# EAGLE design cloudy1 (EAGLE 6.4)
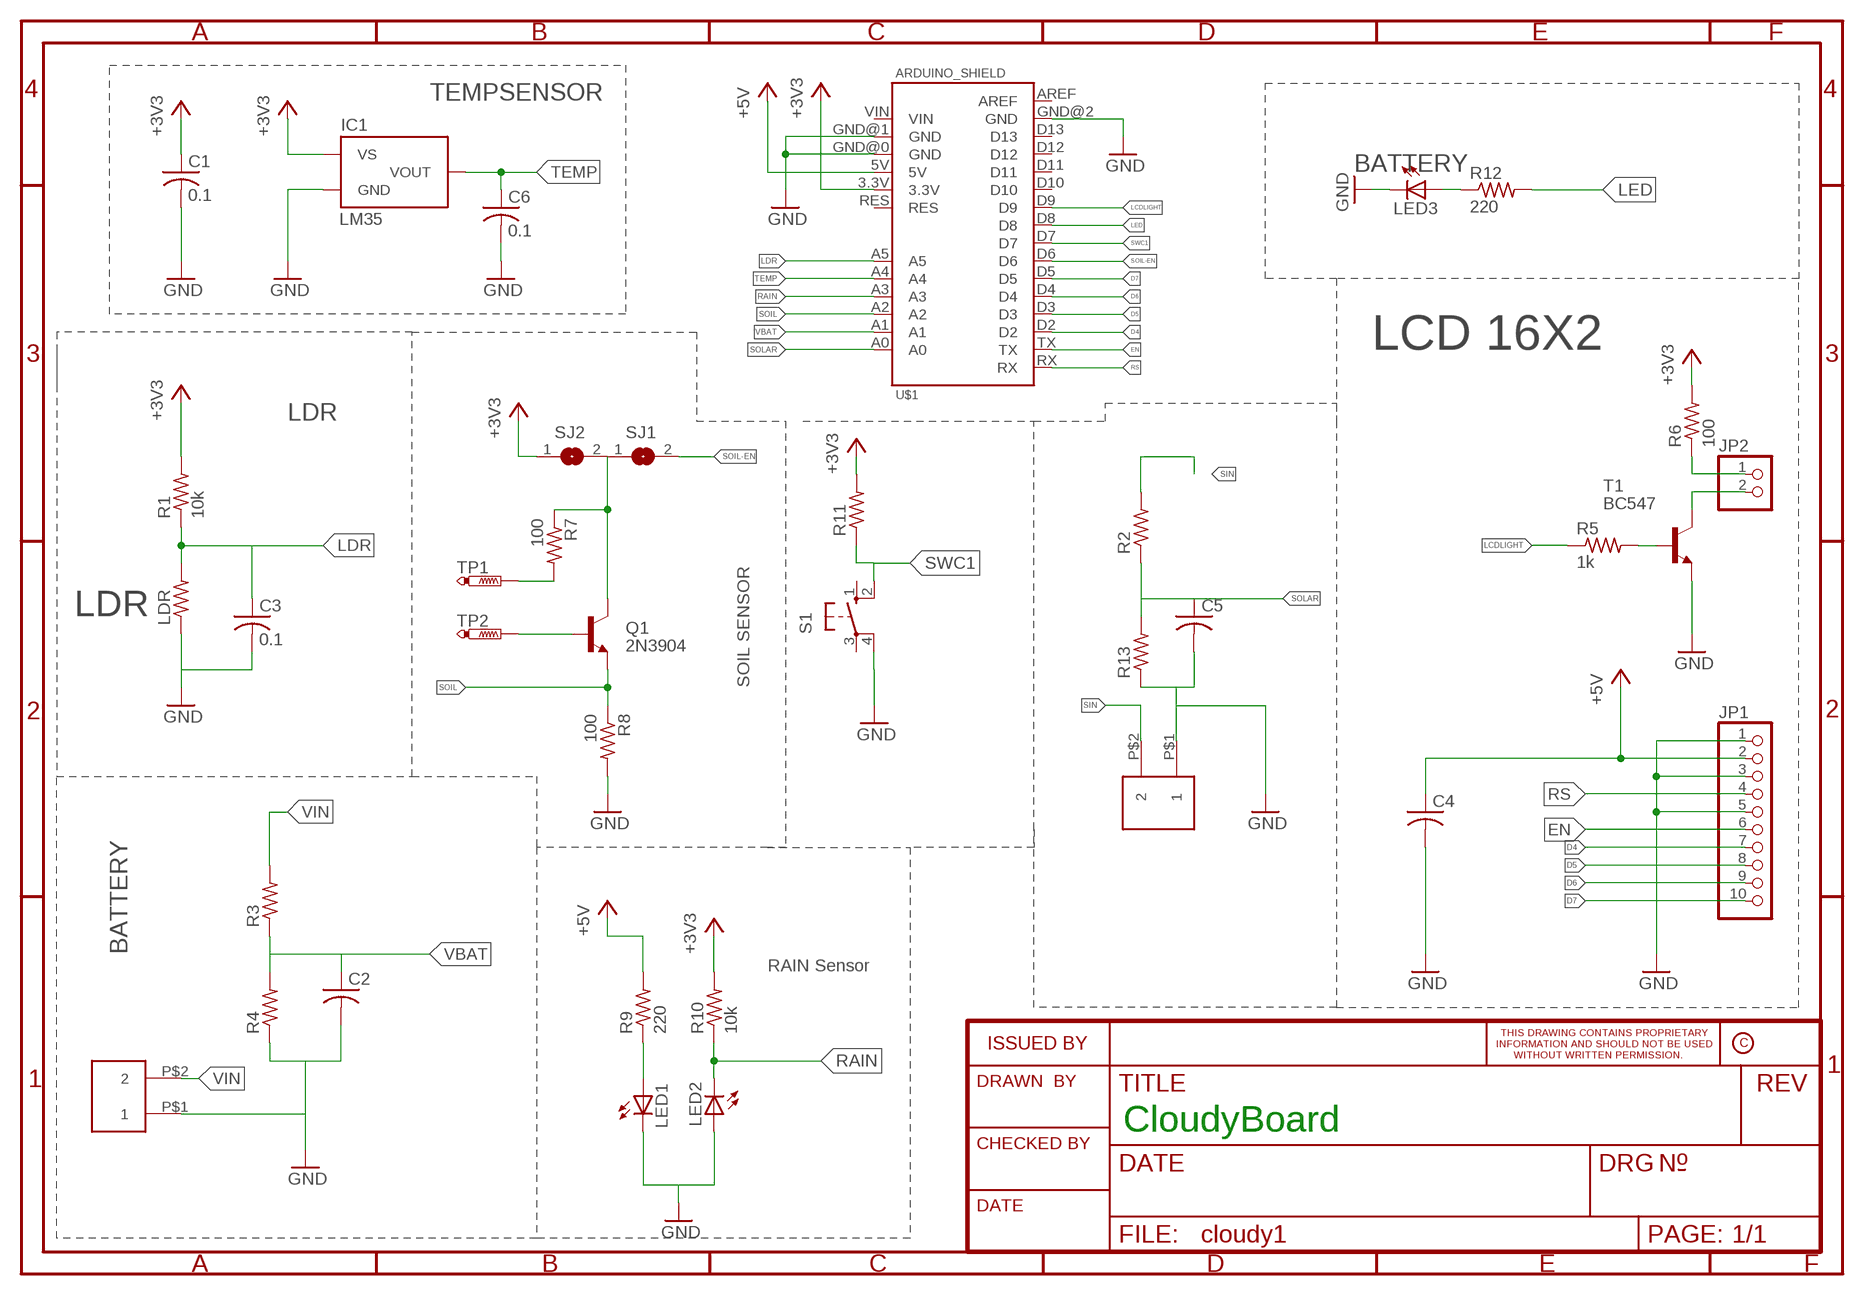
[diagram p0: schematic, sheet 1]

## Parts
C1  0.1  C-USC0805  [C0805]
C2  C-USC0805  [C0805]
C3  0.1  C-USC0805  [C0805]
C4  C-USC0805  [C0805]
C5  C-USC0805  [C0805]
C6  0.1  C-USC0805  [C0805]
IC1  LM35  [TO92]
JP1  PINHD-1X10  [1X10]
JP2  PINHD-1X2  [1X02]
LDR  R-US_0204/5  [0204/5]
LED1  LED5MM  [LED5MM]
LED2  LED5MM  [LED5MM]
LED3  LED5MM  [LED5MM]
Q1  2N3904  [TO92]
R1  10k  R-US_0204/7  [0204/7]
R2  R-US_0204/7  [0204/7]
R3  R-US_0204/7  [0204/7]
R4  R-US_0204/7  [0204/7]
R5  1k  R-US_0204/7  [0204/7]
R6  100  R-US_0204/7  [0204/7]
R7  100  R-US_R0805  [R0805]
R8  100  R-US_R0805  [R0805]
R9  220  R-US_0204/7  [0204/7]
R10  10k  R-US_0204/7  [0204/7]
R11  R-US_0207/10  [0207/10]
R12  220  R-US_0204/7  [0204/7]
R13  R-US_0204/7  [0204/7]
S1  10-XX  [B3F-10XX]
SJ1  SJ  [SJ]
SJ2  SJ  [SJ]
T1  BC547  [TO92]
TP1  PTR1TP19SQ  [TP19SQ]
TP2  PTR1TP19SQ  [TP19SQ]
U$1  ARDUINO_SHIELD  [ARDUINO_SHIELD]
U$2  POWER_TERMINAL  [POWER_TERMINAL_2]
U$3  POWER_TERMINAL  [POWER_TERMINAL_2]

## Nets
+3V3: C1.1 IC1.VS R1.2 R6.2 R10.2 R11.2 SJ2.1 U$1.3.3V
+5V: C4.1 JP1.2 R9.2 U$1.5V
D4: JP1.7 U$1.D2
D5: JP1.8 U$1.D3
D6: JP1.9 U$1.D4
D7: JP1.10 U$1.D5
EN: JP1.6 U$1.TX
GND: C1.2 C2.2 C3.2 C4.2 C5.2 C6.2 IC1.GND JP1.1 JP1.3 JP1.5 LDR.1 LED1.K(C) LED2.A LED3.K(C) R4.1 R8.2 R13.1 S1.4(P1) T1.1(E) U$1.GND@0(GND) U$1.GND@1(GND) U$1.GND@2(GND) U$2.P$1 U$3.P$1
LCDLIGHT: R5.1 U$1.D9
LDR: C3.1 LDR.2 R1.1 U$1.A5
LED: R12.2 U$1.D8
N$1: JP2.1 R6.1
N$2: JP2.2 T1.3(C)
N$3: R5.2 T1.2(B)
N$4: Q1.2(B) TP2.TP
N$5: R7.2 TP1.TP
N$6: Q1.1(C) R7.1 SJ1.1 SJ2.2
N$7: LED1.A R9.1
N$8: LED3.A R12.1
RAIN: LED2.K(C) R10.1 U$1.A3
RS: JP1.4 U$1.RX
SIN: R2.2 U$3.P$2
SOIL: Q1.3(E) R8.1 U$1.A2
SOIL-EN: SJ1.2 U$1.D6
SOLAR: C5.1 R2.1 R13.2 U$1.A0
SWC1: R11.1 S1.2(S1) U$1.D7
TEMP: C6.1 IC1.VOUT U$1.A4
VBAT: C2.1 R3.1 R4.2 U$1.A1
VIN: R3.2 U$2.P$2
Unconnected: S1.1(S) S1.3(P) U$1.AREF U$1.D10 U$1.D11 U$1.D12 U$1.D13 U$1.RES U$1.VIN

## Notes on the sheet
- TEMPSENSOR
- BATTERY
- LCD 16X2
- LDR
- LDR
- SOIL SENSOR
- BATTERY
- RAIN Sensor
- CloudyBoard

## Library data of the parts
C1-C6 = rcl:C-US: CAPACITOR, American symbol
IC1 = CEDT:LM35
JP1 = pinhead:PINHD-1X10: PIN HEADER
JP2 = pinhead:PINHD-1X2: PIN HEADER
LDR R1-R13 = rcl:R-US_: RESISTOR, American symbol
LED1-LED3 = led:LED: LED OSRAM: - CHIPLED LG R971, LG N971, LY N971, LG Q971, LY Q971, LO R971, LY R971 LH N974, LH R974 LS Q976, LO Q976, LY Q976 LO Q996 - Hyper CHIPLED LW Q18S LB Q993, LB Q99A, LB R99A - SideLED LS A670, LO A670, LY A670, LG A670, LP A670 LB A673, LV A673, LT A673, LW A673 LH A674 LY A675 LS A676, LA A676, LO A676, LY A676, LW A676 LS A679, LY A679, LG A679 - Hyper Micro SIDELED® LS Y876, LA Y876, LO Y876, LY Y876 LT Y87S - SmartLED LW L88C, LW L88S LB L89C, LB L89S, LG L890 LS L89K, LO L89K, LY L89K LS L896, LA L896, LO L896, LY L896 - TOPLED LS T670, LO T670, LY T670, LG T670, LP T670 LSG T670, LSP T670, LSY T670, LOP T670, LYG T670 LG T671, LOG T671, LSG T671 LB T673, LV T673, LT T673, LW T673 LH T674 LS T676, LA T676, LO T676, LY T676, LB T676, LH T676, LSB T676, LW T676 LB T67C, LV T67C, LT T67C, LS T67K, LO T67K, LY T67K, LW E67C LS E67B, LA E67B, LO E67B, LY E67B, LB E67C, LV E67C, LT E67C LW T67C LS T679, LY T679, LG T679 LS T770, LO T770, LY T770, LG T770, LP T770 LB T773, LV T773, LT T773, LW T773 LH T774 LS E675, LA E675, LY E675, LS T675 LS T776, LA T776, LO T776, LY T776, LB T776 LHGB T686 LT T68C, LB T68C - Hyper Mini TOPLED® LB M676 - Mini TOPLED Santana® LG M470 LS M47K, LO M47K, LY M47K Source: http://www.osram.convergy.de LUXEON: - LUMILED® LXK2-PW12-R00, LXK2-PW12-S00, LXK2-PW14-U00, LXK2-PW14-V00 LXK2-PM12-R00, LXK2-PM12-S00, LXK2-PM14-U00 LXK2-PE12-Q00, LXK2-PE12-R00, LXK2-PE12-S00, LXK2-PE14-T00, LXK2-PE14-U00 LXK2-PB12-K00, LXK2-PB12-L00, LXK2-PB12-M00, LXK2-PB14-N00, LXK2-PB14-P00, LXK2-PB14-Q00 LXK2-PR12-L00, LXK2-PR12-M00, LXK2-PR14-Q00, LXK2-PR14-R00 LXK2-PD12-Q00, LXK2-PD12-R00, LXK2-PD12-S00 LXK2-PH12-R00, LXK2-PH12-S00 LXK2-PL12-P00, LXK2-PL12-Q00, LXK2-PL12-R00 Source: www.luxeon.com KINGBRIGHT: KA-3528ASYC Source: www.kingbright.com
Q1 = transistor-npn:2N3904: NPN Transistor
S1 = CEDT:10-XX: OMRON SWITCH
SJ1 SJ2 = jumper:SJ: SMD solder JUMPER
T1 = transistor:BC547: NPN TRANSISTOR
TP1 TP2 = testpad:PTR1: TEST PIN
U$1 = CEDTv66:ARDUINO_SHIELD: Standard footprint for Arduino Shield.
U$2 U$3 = Rohit_Libsv2:POWER_TERMINAL

## Board
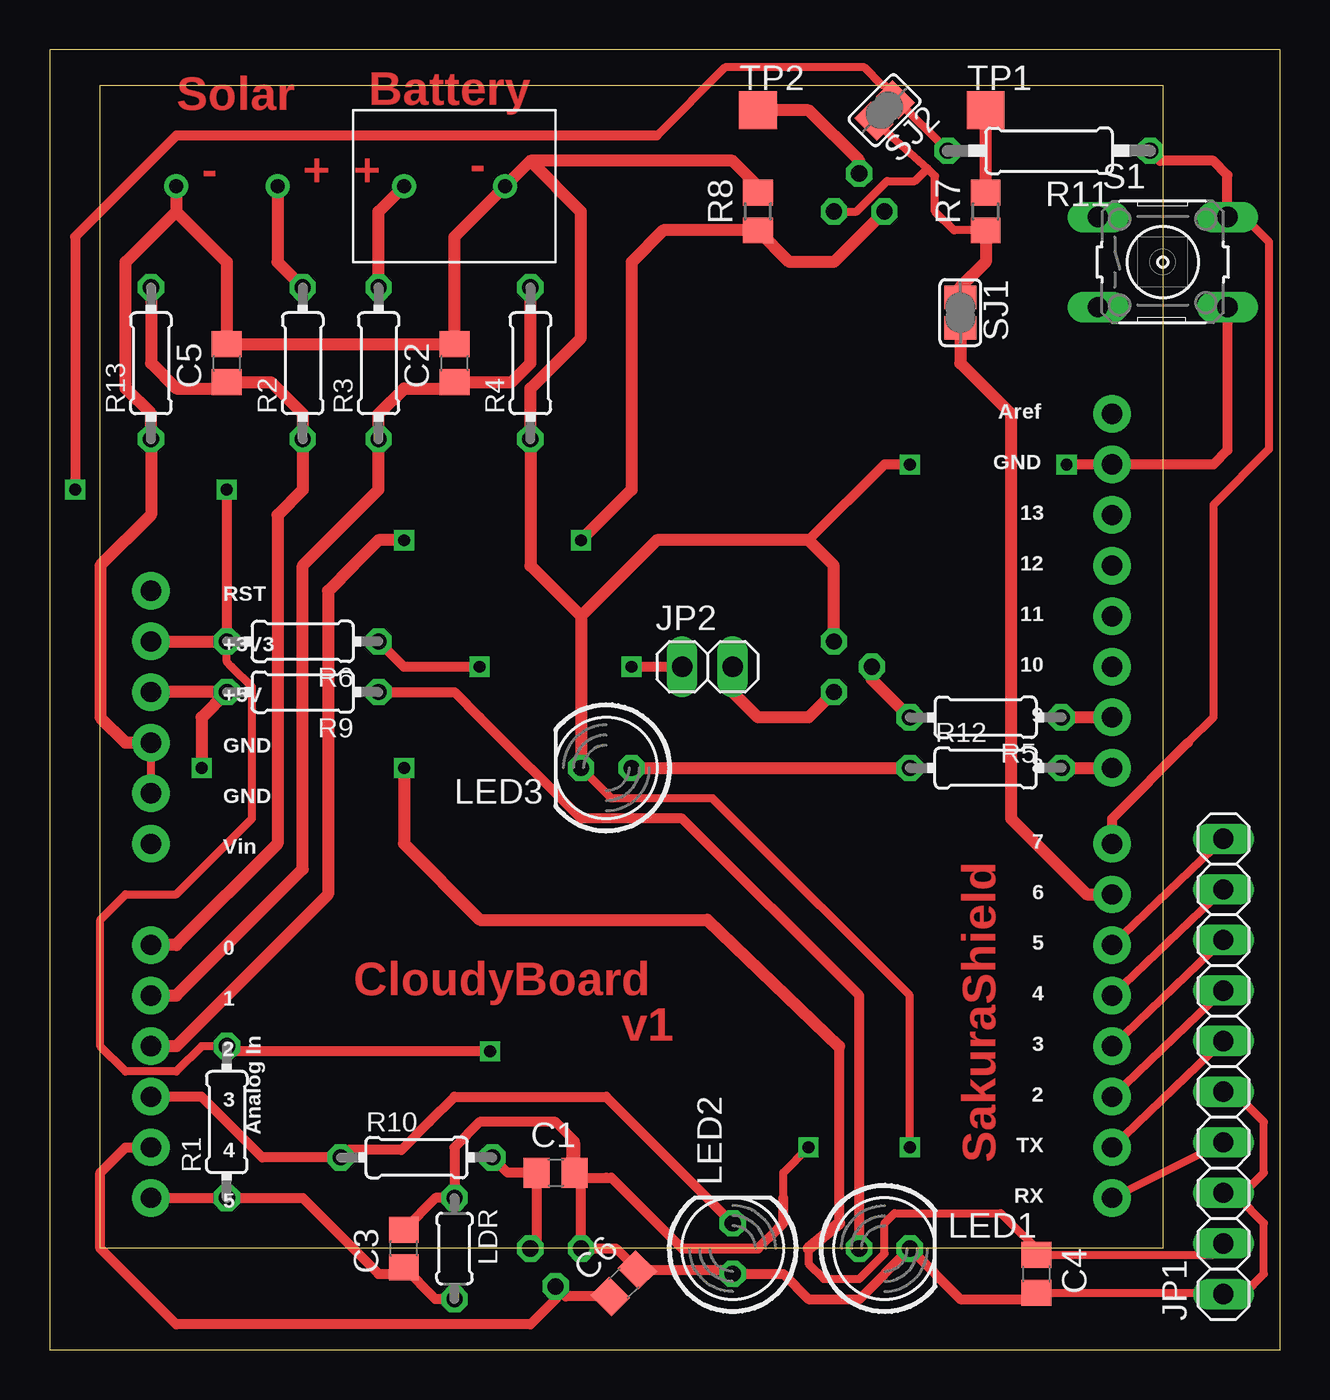
[diagram p1: board, top side]
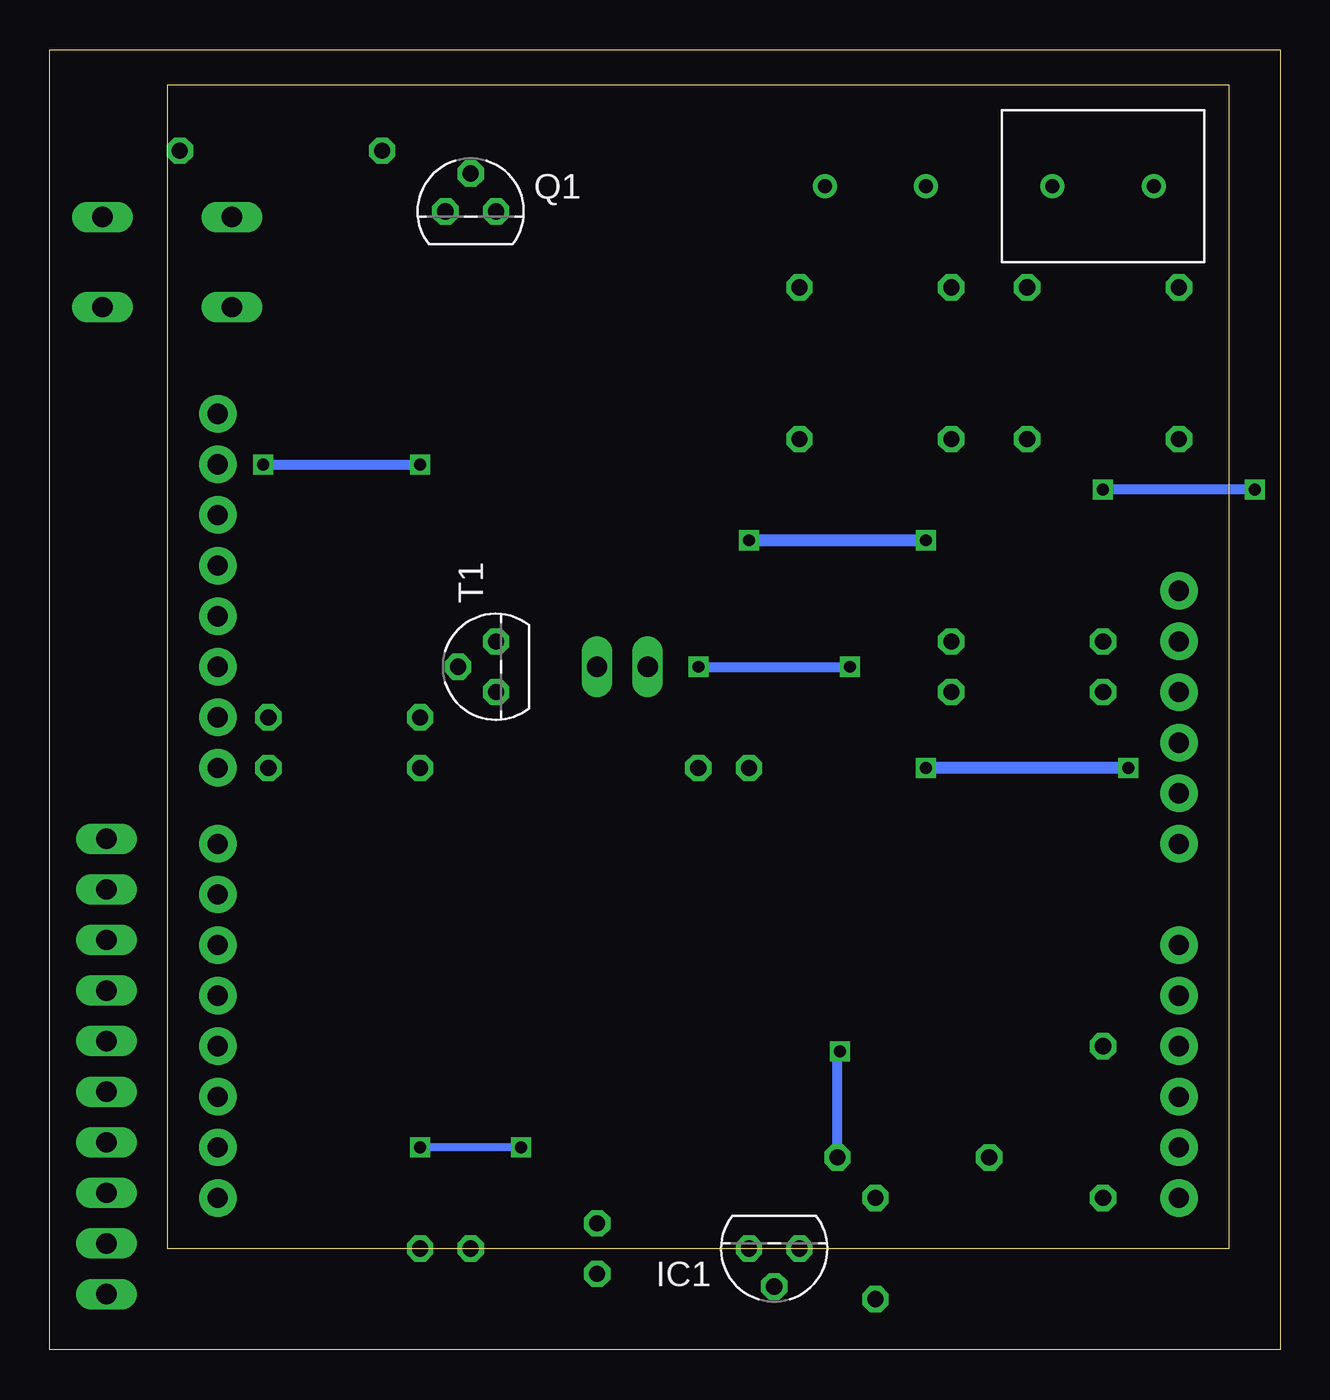
[diagram p2: board, bottom side, seen from below]

Size 61.77 x 65.27 mm. Coordinates in mm from the lower left corner, seen from the top.
Outline: 0,0 61.77,0 61.77,65.27 0,65.27 0,0
Copper layers (1*16): Top 0.035mm / dielectric 1.5mm / Bottom 0.035mm
Design rules "default": minimum track width 10mil, minimum drill 24mil, track to track 8mil, track to pad 8mil, pad to pad 8mil, via to via 8mil, smd to smd 8mil, copper to edge 40mil, drill to drill 8mil, minimum pad ring 10mil, minimum via ring 8mil, stop-mask expansion 4mil, vias tented up to drill 0mil, thermal gap 10mil

### Footprints (pad centres in the part's own frame; a part is rotated, then mirrored left to right if it is on the bottom)
C0805 = smd 1.3 x 1.5: 1 -0.95,0; 2 0.95,0
TO92 = drill 0.813 octagon: GND 1.27,0; VOUT 0,1.905; VS -1.27,0
1X10 = drill 1.016 long: 1 -11.43,0; 2 -8.89,0; 3 -6.35,0; 4 -3.81,0; 5 -1.27,0; 6 1.27,0; 7 3.81,0; 8 6.35,0; 9 8.89,0; 10 11.43,0
1X02 = drill 1.016 long: 1 -1.27,0; 2 1.27,0
0204/5 = drill 0.813 octagon: 1 -2.54,0; 2 2.54,0
LED5MM = drill 0.813 octagon: A -1.27,0; K 1.27,0
TO92' = drill 0.813 octagon: 1 1.27,0; 2 0,1.905; 3 -1.27,0
0204/7 = drill 0.813 octagon: 1 -3.81,0; 2 3.81,0
R0805 = smd 1.3 x 1.5: 1 -0.95,0; 2 0.95,0
0207/10 = drill 0.813 octagon: 1 -5.08,0; 2 5.08,0
B3F-10XX = drill 1.016 long: 1 -3.251,2.261; 2 3.251,2.261; 3 -3.251,-2.261; 4 3.251,-2.261
SJ = smd 1.168 x 1.6: 1 -0.762,0; 2 0.762,0
TP19SQ = smd 1.9 x 1.9: TP 0,0
ARDUINO_SHIELD = drill 1.016 pad 1.88: 3.3V 50.8,27.94; 5V 50.8,30.48; A0 50.8,43.18; A1 50.8,45.72; A2 50.8,48.26; A3 50.8,50.8; A4 50.8,53.34; A5 50.8,55.88; AREF 2.54,16.51; D2 2.54,50.8; D3 2.54,48.26; D4 2.54,45.72; D5 2.54,43.18; D6 2.54,40.64; D7 2.54,38.1; D8 2.54,34.29; D9 2.54,31.75; D10 2.54,29.21; D11 2.54,26.67; D12 2.54,24.13; D13 2.54,21.59; GND@0 50.8,33.02; GND@1 50.8,35.56; GND@2 2.54,19.05; RES 50.8,25.4; RX 2.54,55.88; TX 2.54,53.34; VIN 50.8,38.1
POWER_TERMINAL_2 = drill 0.7: P$1 -2.54,0; P$2 2.54,0

### Placement (x,y rotation side)
C1  25.4,8.89 0 top
C2  20.32,49.53 90 top
C3  17.78,5.08 90 top
C4  49.53,3.81 270 top
C5  8.89,49.53 90 top
C6  28.82,3.34 45 top
IC1  25.4,5.08 180 bottom
JP1  58.93,14.22 90 top
JP2  33.02,34.29 0 top
LDR  20.32,5.08 270 top
LED1  41.91,5.08 0 top
LED2  34.29,5.08 90 top
LED3  27.94,29.21 180 top
Q1  2N3904  [TO92']  40.64,57.15 0 bottom
R1  8.89,11.43 90 top
R2  12.7,49.53 90 top
R3  16.51,49.53 90 top
R4  24.13,49.53 90 top
R5  46.99,31.75 180 top
R6  12.7,35.56 180 top
R7  46.99,57.15 90 top
R8  35.56,57.15 90 top
R9  12.7,33.02 180 top
R10  18.41,9.65 0 top
R11  50.16,60.2 180 top
R12  46.99,29.21 0 top
R13  5.08,49.53 90 top
S1  55.88,54.61 0 top
SJ1  45.72,52.07 270 top
SJ2  41.91,62.23 225 top
T1  BC547  [TO92']  39.37,34.29 90 bottom
TP1  46.99,62.23 0 top
TP2  35.56,62.23 0 top
U$1  55.88,63.5 180 top
U$2  20.32,58.42 180 top
U$3  8.89,58.42 180 bottom

### Tracks (layer width: path | path; a pad name or v marks a point on that pad's centre or on a via)
+3V3  (via drill 0.6)
  Top 0.406: R11.2 42.51,62.77 SJ2.1 42.45,62.96 41.91,63.5 41.78,63.5 40.89,64.39 33.91,64.39 30.48,60.96 | R1.2 7.62,15.24 6.35,13.97 3.81,13.97 2.54,15.24 2.54,21.59 3.81,22.86 6.35,22.86 8.89,25.4 10.16,26.67 10.16,33.27 9.14,34.29 8.89,34.54 R6.2
  Top 0.508: IC1.VS 24.45,5.4 C1.1 22.99,8.89 R10.2 | 30.48,60.96 6.35,60.96 1.27,55.88 v1.27,43.18 | v8.89,43.18 R6.2 | v22.1,14.99 9.14,14.99 R1.2
  Top 0.61: U$1.3.3V R6.2
  Bottom 0.508: v1.27,43.18 v8.89,43.18 | R10.2 22.23,14.86 v22.1,14.99
+5V  (via drill 0.6)
  Top 0.406: JP1.2 58.35,4.76 C4.1 49.53,5.08 48.26,6.35 47.75,6.86 42.42,6.86 41.91,6.35 41.91,4.83 40.64,3.56 38.86,3.56 38.1,4.32 38.1,5.08
  Top 0.508: 39.62,15.24 39.62,6.35
  Top 0.61: U$1.5V R9.2 7.62,31.75 v7.62,29.21 | v17.78,29.21 17.78,25.4 21.59,21.59 33.02,21.59 39.62,15.24 | 39.62,6.35 38.1,5.08
  Bottom 0.61: v7.62,29.21 v17.78,29.21
D4
  Top 0.406: JP1.7 U$1.D2
D5
  Top 0.406: JP1.8 U$1.D3
D6
  Top 0.406: JP1.9 U$1.D4
D7
  Top 0.406: JP1.10 U$1.D5
EN
  Top 0.406: U$1.TX JP1.6
GND  (via drill 0.6)
  Top 0.406: JP1.5 59.18,12.7 59.69,12.7 60.96,11.43 60.96,8.89 59.94,7.87 JP1.3 59.18,7.62 59.69,7.62 60.96,6.35 60.96,3.81 59.94,2.79 JP1.1 58.86,2.86 C4.2 | 25.4,11.43 26.42,10.41 26.42,8.64 27.94,8.64 28.19,8.64 30.23,6.6 31.75,5.08 35.56,5.08 36.58,6.1 36.83,6.35 36.83,7.62 36.83,8.89 v38.1,10.16 | v43.18,10.16 43.18,17.78 34.29,26.67 33.27,27.69 28.19,27.69 LED3.K | U$1.GND@1 U$1.GND@0
  Top 0.508: S1.4 59.13,45.16 58.42,44.45 U$1.GND@2 v51.05,44.45 | C4.2 49.21,2.54 45.72,2.54 LED1.K 40.64,2.54 38.1,2.54 36.83,3.81 LED2.A 34.09,4.01 C6.2 28.42,5.08 IC1.GND 26.67,8.57 C1.2 26.35,10.48 26.16,10.67 | 26.16,10.67 25.4,11.43 | 25.4,11.43 21.59,11.43 20.32,10.16 LDR.1 19.37,7.62 C3.2 | 25.4,11.43 26.16,10.67 | 26.16,10.67 26.16,9.14 26.67,8.64 27.94,8.64 28.19,8.64 30.23,6.6 30.48,6.35 31.75,5.08 35.56,5.08 36.58,6.1 36.83,6.35 36.83,7.62 | v43.18,44.45 41.91,44.45 38.1,40.64
  Top 0.61: R8.2 35.56,58.42 34.29,59.69 24.13,59.69 | 24.13,59.69 U$2.P$1 20.32,55.88 C2.2 C5.2 8.89,54.61 6.35,57.15 | U$3.P$1 6.35,57.15 | 6.35,57.15 3.81,54.61 3.81,48.26 5.08,46.99 R13.1 5.08,41.91 2.54,39.37 2.54,31.75 3.81,30.48 U$1.GND@0 | 24.13,59.69 26.67,57.15 26.67,50.8 24.13,48.26 R4.1 24.13,39.37 26.67,36.83 | 26.67,36.83 LED3.K | T1.1 39.37,39.37 38.1,40.64 30.48,40.64 26.67,36.83
  Bottom 0.406: v38.1,10.16 v43.18,10.16
  Bottom 0.508: v51.05,44.45 v43.18,44.45
LCDLIGHT
  Top 0.61: U$1.D9 R5.1
LDR
  Top 0.508: LDR.2 19.37,2.54 C3.1 17.46,3.81 16.51,3.81 12.7,7.62 R1.1 U$1.A5
LED
  Top 0.61: R12.2 U$1.D8
N$1  (via drill 0.6)
  Top 0.508: JP2.1 v29.21,34.29 | v21.59,34.29 17.78,34.29 R6.1
  Bottom 0.508: v29.21,34.29 v21.59,34.29
N$2
  Top 0.61: T1.3 38.1,31.75 35.56,31.75 34.29,33.02 JP2.2
N$3
  Top 0.61: T1.2 41.27,33.66 R5.2
N$4
  Top 0.61: Q1.2 40.64,59.69 38.1,62.23 TP2.TP
N$5
  Top 0.61: R7.2 TP1.TP
N$6
  Top 0.406: Q1.1 40.51,57.15 42.04,58.67 43.43,58.67 44.07,59.31 | R7.1 45.4,56.2 44.45,57.15 44.45,58.93 44.07,59.31 | 44.07,59.31 SJ2.2
  Top 0.61: R7.1 46.99,54.61 45.72,53.34 SJ1.1
N$7
  Top 0.508: R9.1 20.32,33.02 21.59,31.75 26.67,26.67 31.75,26.67 40.64,17.78 LED1.A
N$8
  Top 0.61: LED3.A R12.1
RAIN
  Top 0.508: LED2.K 27.94,12.7 20.32,12.7 19.05,11.43 17.65,10.03 14.99,10.03 R10.1 10.67,9.65 7.62,12.7 U$1.A3
RS
  Top 0.406: U$1.RX JP1.4
SIN
  Top 0.61: U$3.P$2 11.43,54.61 R2.2
SOIL  (via drill 0.6)
  Top 0.61: Q1.3 39.37,54.61 37.15,54.61 R8.1 30.8,56.2 29.21,54.61 29.21,43.18 v26.67,40.64 | v17.78,40.64 16.51,40.64 15.24,39.37 13.97,38.1 13.97,22.86 11.43,20.32 6.35,15.24 U$1.A2
  Bottom 0.61: v26.67,40.64 v17.78,40.64
SOIL-EN
  Top 0.61: SJ1.2 45.72,49.53 48.26,46.99 48.26,26.67 52.07,22.86 U$1.D6
SOLAR
  Top 0.61: R13.2 5.08,49.53 6.35,48.26 8.57,48.26 C5.1 11.11,48.58 12.7,46.99 R2.1 12.7,43.18 11.43,41.91 11.43,25.4 6.35,20.32 U$1.A0
SWC1
  Top 0.406: S1.2 59.97,56.87 60.96,55.88 61.21,55.63 61.21,45.21 58.42,42.42 58.42,31.75 57.15,30.48
  Top 0.508: S1.2 59.13,58.98 58.42,59.69 55.75,59.69 R11.1 | U$1.D7 53.34,26.67 57.15,30.48
TEMP
  Top 0.508: C6.1 25.91,2.67 IC1.VOUT 25.4,2.54 24.13,1.27 6.35,1.27 2.54,5.08 2.54,8.89 3.81,10.16 U$1.A4
VBAT
  Top 0.61: R4.2 24.13,49.53 23.18,48.58 C2.1 20,48.26 17.78,48.26 16.51,46.99 R3.1 16.51,43.18 12.7,39.37 12.7,24.13 6.35,17.78 U$1.A1
VIN
  Top 0.61: R3.2 16.51,57.15 U$2.P$2

### Text on the board
Top: Solar | Battery | - | - | + | + | CloudyBoard | v1 | SakuraShield